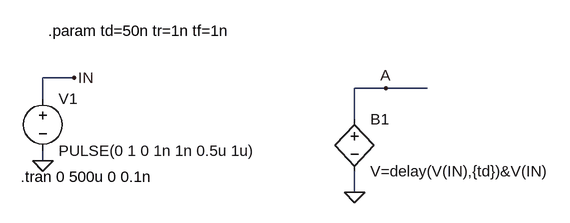
[diagram p0: schematic Single Behavioral Source.asc]
Single Behavioral Source.asc, the LTspice schematic file:
Version 4
SHEET 1 880 680
WIRE 64 96 16 96
WIRE 544 112 496 112
WIRE 608 112 544 112
WIRE 16 128 16 96
WIRE 496 160 496 112
WIRE 16 224 16 208
WIRE 496 272 496 240
FLAG 16 224 0
FLAG 64 96 IN
FLAG 496 272 0
FLAG 544 112 A
SYMBOL voltage 16 112 R0
WINDOW 123 0 0 Left 0
WINDOW 39 0 0 Left 0
SYMATTR InstName V1
SYMATTR Value PULSE(0 1 0 1n 1n 0.5u 1u)
SYMBOL bv 496 144 R0
SYMATTR InstName B1
SYMATTR Value V=delay(V(IN),{td})&V(IN)
TEXT -18 248 Left 2 !.tran 0 500u 0 0.1n
TEXT 24 24 Left 2 !.param td=50n tr=1n tf=1n

The netlist it stands for:
* Single Behavioral Source.asc
V1 IN 0 PULSE(0 1 0 1n 1n 0.5u 1u)
B1 A 0 V=delay(V(IN),{td})&V(IN)
.tran 0 500u 0 0.1n
.param td=50n tr=1n tf=1n
.backanno
.end